# EasyEDA Pro project stm32-motordrive.epro, board PCB3_copy1
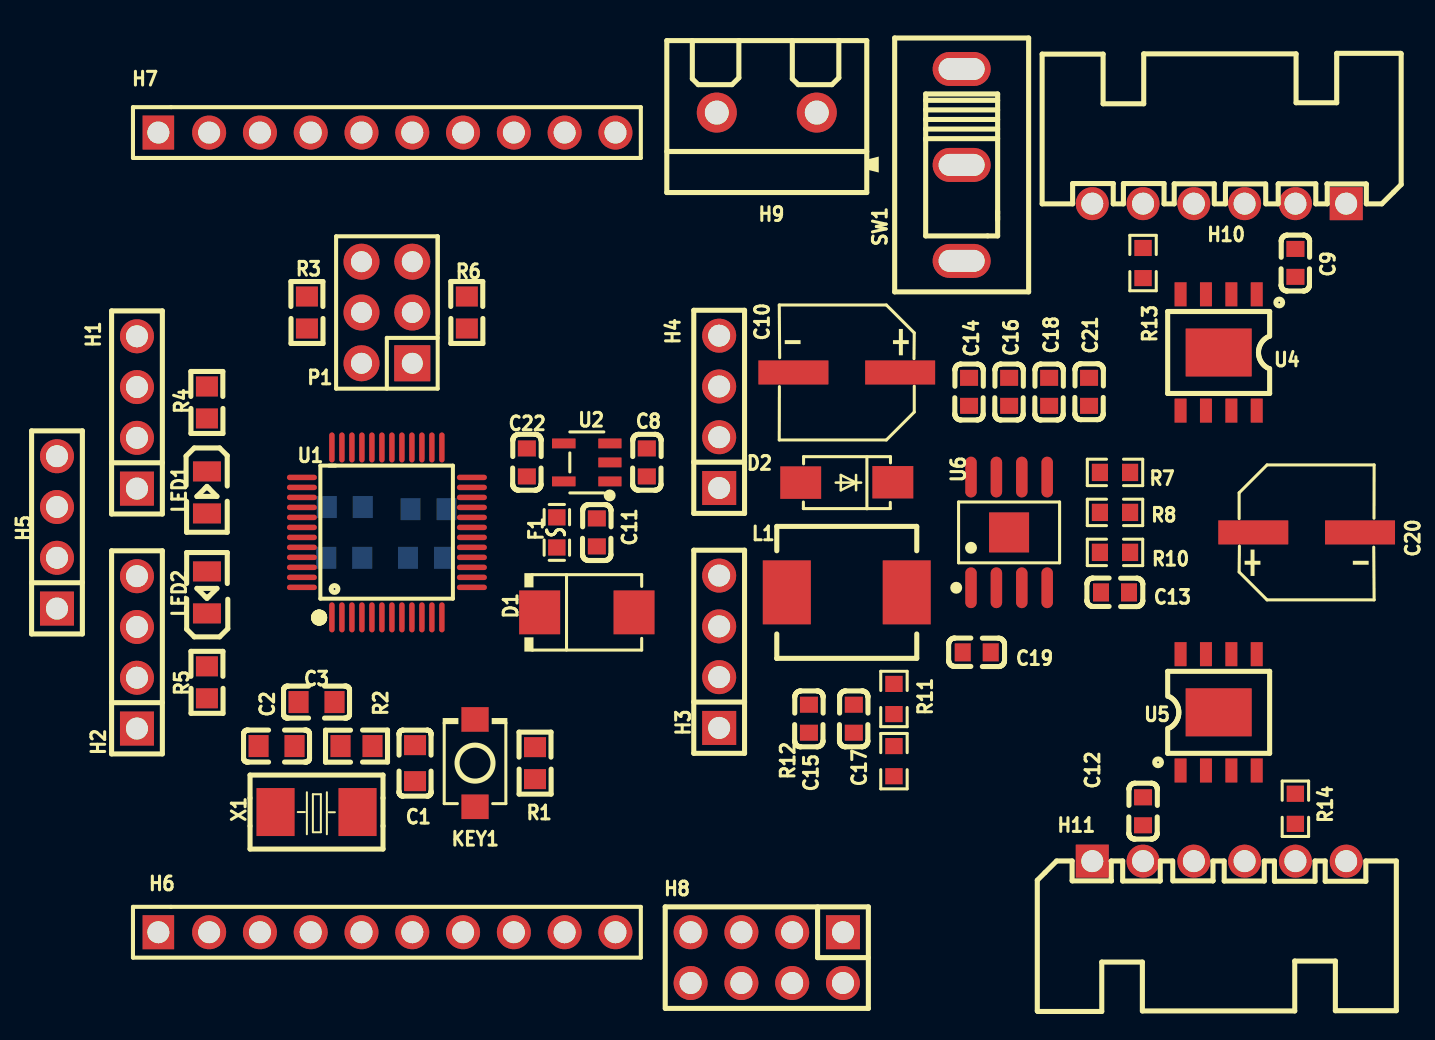
[diagram p7: board, top side]
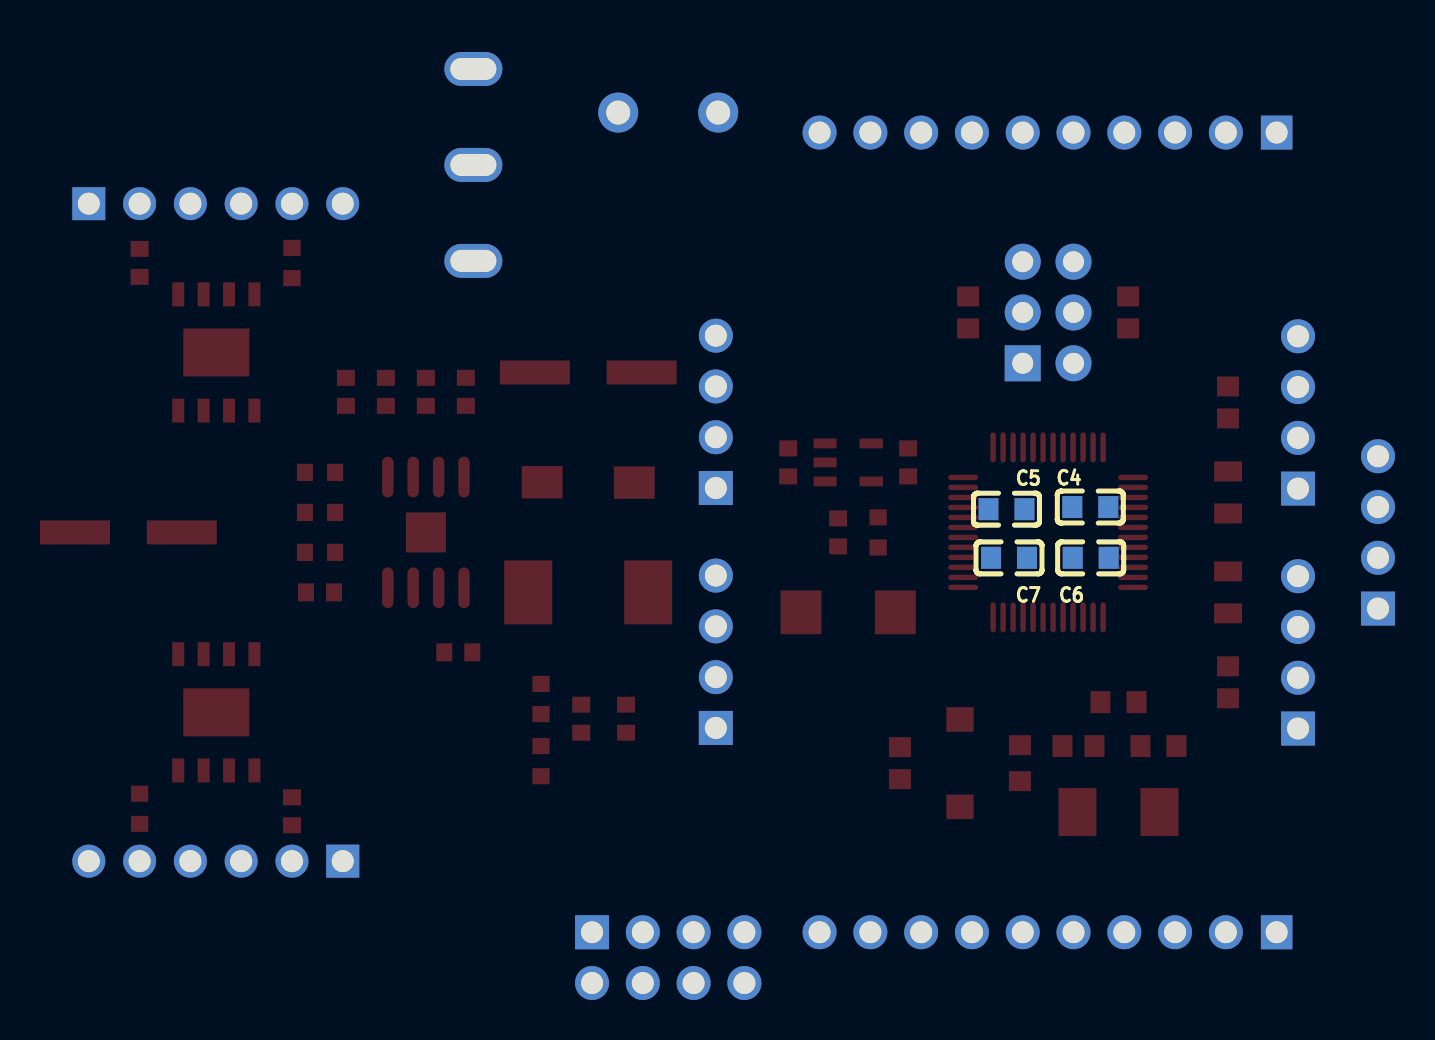
[diagram p8: board, bottom side, seen from below]

No outline. copper layers: Top Layer, Bottom Layer. Coordinates in mm from the lowest, leftmost part position.
Stack: Top Layer 0.035mm / Dielectric1 1.51mm FR4 er 4.5 / Bottom Layer 0.035mm

## Design rules (mm)
template: JLCPCB Capability(Two Layers Board)
spacing copperThickness1oz (default): track to track 0.102, other pairs 0.152 to 0.3
spacing copperThickness2oz: track to track 0.203, other pairs 0.152 to 0.3
track width copperThickness1oz (default): min 0.127, default 0.254, max 2.54
track width copperThickness2oz: min 0.203, default 0.254, max 2.54
differential pair differentialPair (default): width min 0.127, default 0.254, max 2.54; gap min 0.152, default 0.152
via viaSize (default): diameter min 0.5, default 0.61, max 10; hole min 0.3, default 0.305, max 6.3

## Placement (name value [footprint] x y rotation side)
C1  104  [C0603]  17.91 9.73 270 top
C2  22P  [C0603]  10.98 10.58 0 top
C3  22P  [C0603]  12.98 12.78 0 top
C4  104  [C0603]  14.39 22.54 180 bottom
C5  104  [C0603]  18.58 22.43 0 bottom
C6  104  [C0603]  14.37 20 180 bottom
C7  104  [C0603]  18.46 20 0 bottom
C8  1uF  [C0603#2]  29.5 24.77 270 top
C9  0.1uF  [C0603#2]  61.94 34.75 90 top
C10  220uF 25V  [CAP-SMD_BD6.3-L6.6-W6.6-LS7.2-FD]  39.5 29.27 180 top
C11  1uF  [C0603#2]  27 21.27 90 top
C12  0.1uF  [C0603#2]  54.32 7.32 270 top
C13  100nF  [C0603#2]  52.92 18.27 0 top
C14  47uF  [C0603#2]  45.62 28.3 90 top
C15  22nF  [C0603#2]  37.61 11.95 90 top
C16  22uF  [C0603#2]  47.62 28.3 90 top
C17  4.7uF  [C0603#2]  39.85 11.95 90 top
C18  4.7uF  [C0603#2]  49.62 28.3 90 top
C19  10nF  [C0603#2]  46 15.27 0 top
C20  220uF 25V  [CAP-SMD_BD6.3-L6.6-W6.6-LS7.2-FD]  62.5 21.27 0 top
C21  0.1uF  [C0603#2]  51.62 28.3 270 top
C22  0.1uF  [C0603#2]  23.5 24.77 270 top
D1  SMBJ3.3A  [SMB_L4.6-W3.6-LS5.3-RD]  26.5 17.27 0 top
D2  SS54  [SMA_L4.3-W2.6-LS5.0-FD]  39.5 23.77 0 top
F1  BSMD0603-050-6V  [F0603]  25 21.27 270 top
H1  PZ254V-11-04P  [HDR-TH_4P-P2.54-V-M]  4 27.27 90 top
H2  PZ254V-11-04P  [HDR-TH_4P-P2.54-V-M]  4 15.27 90 top
H3  PZ254V-11-04P  [HDR-TH_4P-P2.54-V-M]  33.12 15.3 90 top
H4  PZ254V-11-04P  [HDR-TH_4P-P2.54-V-M]  33.12 27.3 90 top
H5  PZ254V-11-04P  [HDR-TH_4P-P2.54-V-M]  0 21.27 90 top
H6  2.54-1*10P针  [HDR-TH_10P-P2.54-V-M-1]  16.5 1.27 0 top
H7  2.54-1*10P针  [HDR-TH_10P-P2.54-V-M-1]  16.5 41.27 0 top
H8  PZ2.54-2*4  [HDR-TH_8P-P2.54-V-M-R2-C4-S2.54]  35.5 0 180 top
H9  XY301V-A-5.0-2P  [CONN-TH_XY301V-A-5.0-2P]  35.5 42.27 0 top
H10  -  [XH2.54-LI-6P弯针]  59.5 41.27 270 top
H11  -  [XH2.54-LI-6P弯针]  56.76 1.27 90 top
KEY1  TS-1088-AR02016  [SW-SMD_L3.9-W3.0-P4.45]  20.91 9.73 90 top
L1  6.8uH  [IND-SMD_L7.0-W6.6]  39.5 18.27 0 top
LED1  NCD0805R1  [LED0805-R-RD]  7.5 23.27 270 top
LED2  NCD0805R1  [LED0805-R-RD]  7.5 18.27 90 top
P1  2.54-2*3P针  [HDR-TH_6P-P2.54-V-M-R2-C3-S2.54-1]  16.5 32.27 90 top
R1  10k  [R0603#2]  23.91 9.73 90 top
R2  1M  [R0603#2]  14.98 10.58 0 top
R3  10k  [R0603#2]  12.5 32.27 90 top
R4  510R  [R0603#2]  7.5 27.77 270 top
R5  510R  [R0603#2]  7.5 13.77 90 top
R6  10k  [R0603#2]  20.5 32.27 270 top
R7  10K(%0.1)  [R0603]  52.92 24.27 180 top
R8  0  [R0603]  52.92 22.27 180 top
R10  6.8kNTC  [R0603]  52.92 20.27 0 top
R11  10K(%0.1)  [R0603]  41.86 12.94 90 top
R12  3.3K  [R0603]  41.86 9.83 90 top
R13  R250  [R0603]  54.32 34.74 90 top
R14  R250  [R0603]  61.94 7.45 270 top
SW1  -  [SW-TH_SHOU-HAN_SS12D10G4]  45.5 39.27 270 top
U1  STM32F103C8T6  [LQFP-48_L7.0-W7.0-P0.50-LS9.0-BL]  16.5 21.27 0 top
U2  RT9013-33GB  [SOT-23-5_L3.0-W1.7-P0.95-LS2.8-BL]  26.5 24.77 90 top
U4  AT8236  [ESOP-8_L4.9-W3.9-P1.27-LS6.0-BL-EP]  58.1 30.27 180 top
U5  AT8236  [ESOP-8_L4.9-W3.9-P1.27-LS6.0-BL-EP]  58.1 12.27 0 top
U6  RT8289GSP  [SOIC-8_L5.0-W4.0-P1.27-LS6.0-BL-EP2.0]  47.62 21.27 0 top
X1  8MHz  [CRYSTAL-SMD_L5.0-W3.2]  12.98 7.28 0 top

## Footprints (pads in the part's own frame, mm; a bottom-side part is the same pattern mirrored in y, then rotated)
C0603
  rect 1x1.1 smd: 1(0.9,0) 2(-0.9,0)
C0603#2
  rect 0.8x0.9 smd: 1(-0.7,0) 2(0.7,0)
CAP-SMD_BD6.3-L6.6-W6.6-LS7.2-FD
  rect 3.5x1.2 smd: 1(-2.67,0) 2(2.67,0)
CONN-TH_XY301V-A-5.0-2P
  round 2 hole 1.2: 1(-2.5,0) 2(2.5,0)
CRYSTAL-SMD_L5.0-W3.2
  rect 1.9x2.4 smd: 1(-2.05,0) 2(2.05,0)
ESOP-8_L4.9-W3.9-P1.27-LS6.0-BL-EP
  rect 0.6x1.2 smd: 1(-1.905,-2.909) 2(-0.635,-2.909) 3(0.635,-2.909) 4(1.905,-2.909) 5(1.905,2.909) 6(0.635,2.909) 7(-0.635,2.909) 8(-1.905,2.909)
  rect 3.3x2.4 smd: 9(0,0)
F0603
  rect 0.806x0.864 smd: 1(-0.753,0) 2(0.753,0)
HDR-TH_4P-P2.54-V-M
  rect 1.7x1.7 hole 1.1: 1(-3.81,0)
  round 1.7 hole 1.1: 2(-1.27,0) 3(1.27,0) 4(3.81,0)
HDR-TH_6P-P2.54-V-M-R2-C3-S2.54-1
  rect 1.8x1.8 hole 1.05: 1(-2.54,-1.27)
  round 1.8 hole 1.05: 2(-2.54,1.27) 3(0,-1.27) 4(0,1.27) 5(2.54,-1.27) 6(2.54,1.27)
HDR-TH_8P-P2.54-V-M-R2-C4-S2.54
  rect 1.7x1.7 hole 1.1: 1(-3.81,-1.27)
  round 1.7 hole 1.1: 2(-3.81,1.27) 3(-1.27,-1.27) 4(-1.27,1.27) 5(1.27,-1.27) 6(1.27,1.27) 7(3.81,-1.27) 8(3.81,1.27)
HDR-TH_10P-P2.54-V-M-1
  rect 1.575x1.7 hole 1.1: 1(-11.43,0)
  round 1.7 hole 1.1: 2(-8.89,0) 3(-6.35,0) 4(-3.81,0) 5(-1.27,0) 6(1.27,0) 7(3.81,0) 8(6.35,0) 9(8.89,0) 10(11.43,0)
IND-SMD_L7.0-W6.6
  rect 2.4x3.2 smd: 1(-3,0) 2(3,0)
LED0805-R-RD
  rect 1x1.399 smd: 1(1.05,0) 2(-1.05,0)
LQFP-48_L7.0-W7.0-P0.50-LS9.0-BL
  oval 0.27x1.5 smd: 1(-2.75,-4.25) 2(-2.25,-4.25) 3(-1.75,-4.25) 4(-1.25,-4.25) 5(-0.75,-4.25) 6(-0.25,-4.25) 7(0.25,-4.25) 8(0.75,-4.25) 9(1.25,-4.25) 10(1.75,-4.25) 11(2.25,-4.25) 12(2.75,-4.25) 25(2.75,4.25) 26(2.25,4.25) 27(1.75,4.25) 28(1.25,4.25) 29(0.75,4.25) 30(0.25,4.25) 31(-0.25,4.25) 32(-0.75,4.25) 33(-1.25,4.25) 34(-1.75,4.25) 35(-2.25,4.25) 36(-2.75,4.25)
  oval 1.5x0.27 smd: 13(4.25,-2.75) 14(4.25,-2.25) 15(4.25,-1.75) 16(4.25,-1.25) 17(4.25,-0.75) 18(4.25,-0.25) 19(4.25,0.25) 20(4.25,0.75) 21(4.25,1.25) 22(4.25,1.75) 23(4.25,2.25) 24(4.25,2.75) 37(-4.25,2.75) 38(-4.25,2.25) 39(-4.25,1.75) 40(-4.25,1.25) 41(-4.25,0.75) 42(-4.25,0.25) 43(-4.25,-0.25) 44(-4.25,-0.75) 45(-4.25,-1.25) 46(-4.25,-1.75) 47(-4.25,-2.25) 48(-4.25,-2.75)
R0603
  rect 0.806x0.864 smd: 1(-0.753,0) 2(0.753,0)
R0603#2
  rect 1x1.1 smd: 1(0.8,0) 2(-0.8,0)
SMA_L4.3-W2.6-LS5.0-FD
  rect 2.046x1.62 smd: 1(-2.304,-0.009) 2(2.304,0.009)
SMB_L4.6-W3.6-LS5.3-RD
  rect 2.047x2.192 smd: 1(-2.361,0) 2(2.361,0)
SOIC-8_L5.0-W4.0-P1.27-LS6.0-BL-EP2.0
  oval 0.574x2.038 smd: 1(-1.905,-2.769) 2(-0.635,-2.769) 3(0.635,-2.769) 4(1.905,-2.769) 5(1.905,2.769) 6(0.635,2.769) 7(-0.635,2.769) 8(-1.905,2.769)
  rect 2x2 smd: 9(0,0)
SOT-23-5_L3.0-W1.7-P0.95-LS2.8-BL
  rect 0.49x1.157 smd: 1(-0.95,-1.153) 2(0,-1.153) 3(0.95,-1.153)
  rect 0.49x1.175 smd: 4(0.95,1.153) 5(-0.95,1.153)
SW-SMD_L3.9-W3.0-P4.45
  rect 1.23x1.36 smd: 1(-2.185,0) 2(2.185,0)
SW-TH_SHOU-HAN_SS12D10G4
  oval 1.7x2.9 hole 1.1x2.3: 1(-5.181,-0.254) 2(-0.381,-0.254) 3(4.419,-0.254)
XH2.54-LI-6P弯针
  rect 1.65x1.65 hole 1.1: 1(3.556,4.979)
  round 1.65 hole 1.1: 2(3.556,2.438) 3(3.556,-0.102) 4(3.556,-2.642) 5(3.556,-5.181) 6(3.556,-7.721)

## Nets
As in the schematic.

Pads without a net: SW1 1; U2 4; U6 2 3
